# Altium schematic sheet Connectors.SchDoc
size A4; SheetNumber: 4; SheetTotal: 4
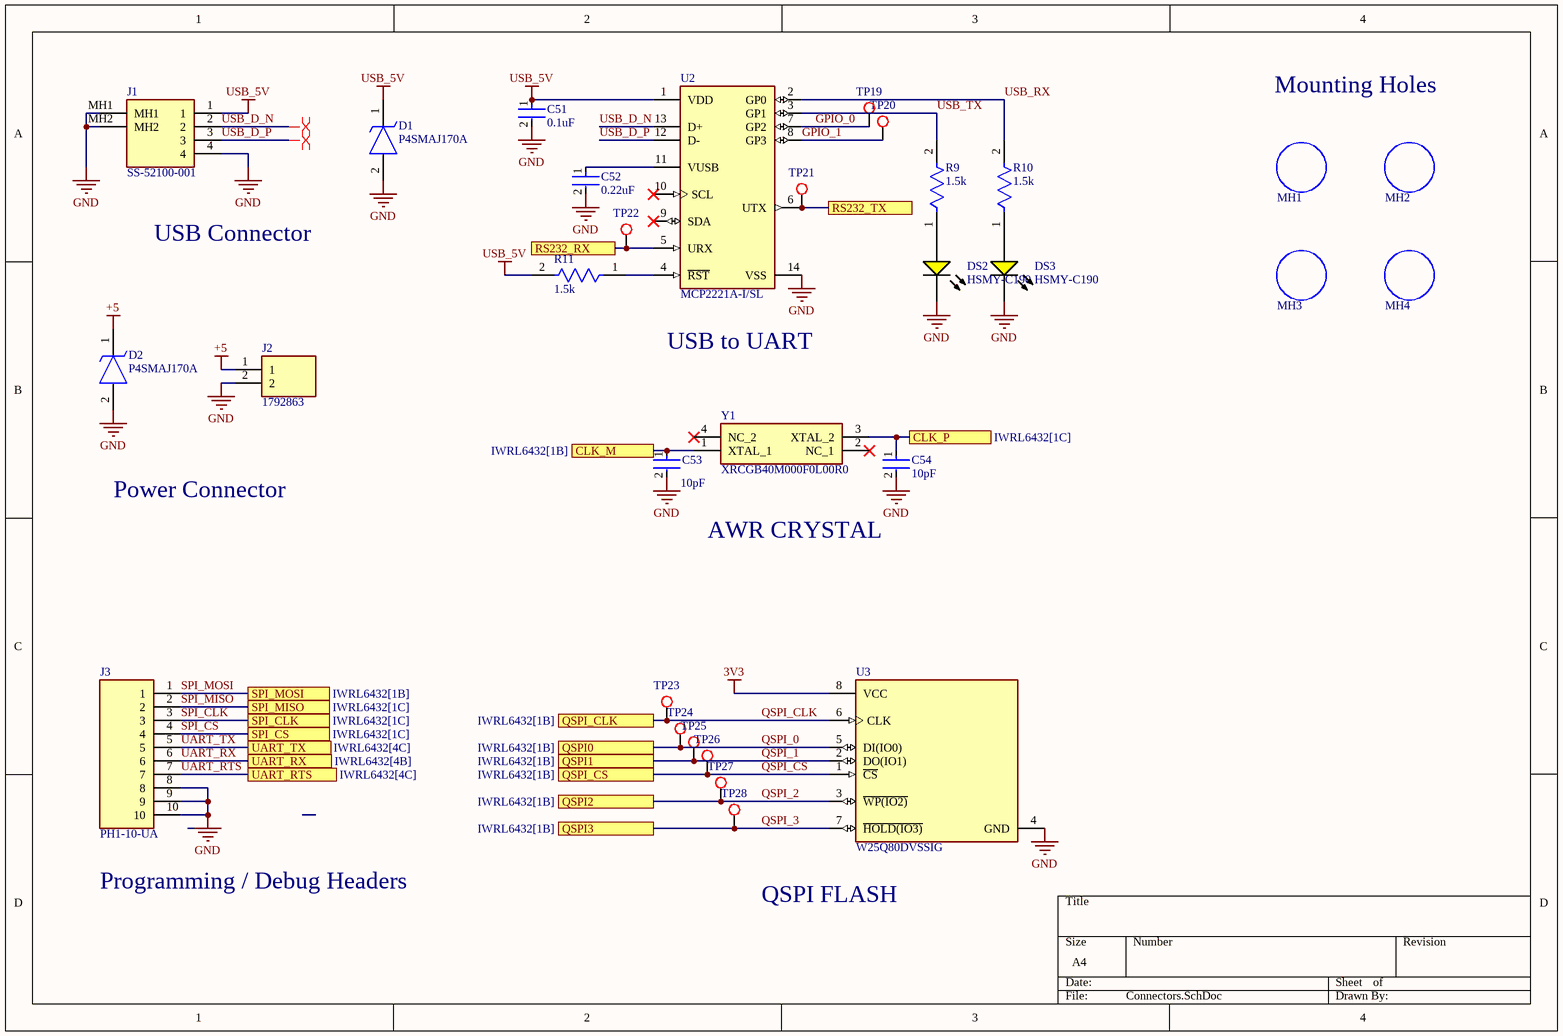
[diagram p0: Connectors.SchDoc]

## Parts
C51  0.1uF  [FP-CC0603-DA-MFG]
C52  0.22uF  [FP-C0603C-CF-MFG]
C53  10pF  [FP-CL10-IPC_B]
C54  10pF  [FP-CL10-IPC_B]
D1  P4SMAJ170A  [DIOM5027X240N]
D2  P4SMAJ170A  [DIOM5027X240N]
DS2  HSMY-C190  [AVAG-HSMX-C190_V]
DS3  HSMY-C190  [AVAG-HSMX-C190_V]
J1  SS-52100-001  [SS52100001]
J2  1792863  [1792863]
J3  PH1-10-UA  [HDRV10W64P0X254_1X10_2540X249X886P]
MH1  MH?  [Mounting Hole]  (value not drawn)
MH2  MH?  [Mounting Hole]  (value not drawn)
MH3  MH?  [Mounting Hole]  (value not drawn)
MH4  MH?  [Mounting Hole]  (value not drawn)
R9  1.5k  [FP-RC1608-IPC_B]
R10  1.5k  [FP-RC1608-IPC_B]
R11  1.5k  [FP-RC1608-IPC_B]
TP19  TP_1  [Testpoint]  (value not drawn)
TP20  TP_1  [Testpoint]  (value not drawn)
TP21  TP_1  [Testpoint]  (value not drawn)
TP22  TP_1  [Testpoint]  (value not drawn)
TP23  TP_1  [Testpoint]  (value not drawn)
TP24  TP_1  [Testpoint]  (value not drawn)
TP25  TP_1  [Testpoint]  (value not drawn)
TP26  TP_1  [Testpoint]  (value not drawn)
TP27  TP_1  [Testpoint]  (value not drawn)
TP28  TP_1  [Testpoint]  (value not drawn)
U2  MCP2221A-I/SL  [FP-C04-065-SL-MFG]
U3  W25Q80DVSSIG  [FP-SS-MFG]
Y1  XRCGB40M000F0L00R0  [XRCGB]

## Ports
CLK_M (see IWRL6432[1B]), CLK_P (see IWRL6432[1C]), QSPI0 (see IWRL6432[1B]), QSPI1 (see IWRL6432[1B]), QSPI2 (see IWRL6432[1B]), QSPI3 (see IWRL6432[1B]), QSPI_CLK (see IWRL6432[1B]), QSPI_CS (see IWRL6432[1B]), RS232_RX (see IWRL6432[4A]), RS232_TX (see IWRL6432[1C]), SPI_CLK (see IWRL6432[1C]), SPI_CS (see IWRL6432[1C]), SPI_MISO (see IWRL6432[1C]), SPI_MOSI (see IWRL6432[1B]), UART_RTS (see IWRL6432[4C]), UART_RX (see IWRL6432[4B]), UART_TX (see IWRL6432[4C])

## Nets
3V3: U3.8(VCC)
+5: D2.1(K) J2.1
GND: C51.2 C52.2 C53.2 C54.2 D1.2(A) D2.2(A) DS2.2(K) DS3.2(K) J1.4 J1.MH1 J1.MH2 J2.2 J3.8 J3.9 J3.10 U2.14(VSS) U3.4(GND)
USB_5V: C51.1 D1.1(K) J1.1 R11.2 U2.1(VDD)
CLK_M: C53.1 Y1.1(XTAL_1) ; port CLK_M
CLK_P: C54.1 Y1.3(XTAL_2) ; port CLK_P
GPIO_0: TP19.0 U2.7(GP2)
GPIO_1: TP20.0 U2.8(GP3)
QSPI_0: TP24.0 U3.5(DI(IO0)) ; port QSPI0
QSPI_1: TP25.0 U3.2(DO(IO1)) ; port QSPI1
QSPI_2: TP27.0 U3.3(~{WP(IO2)}) ; port QSPI2
QSPI_3: TP28.0 U3.7(~{HOLD(IO3)}) ; port QSPI3
QSPI_CLK: TP23.0 U3.6(CLK) ; port QSPI_CLK
QSPI_CS: TP26.0 U3.1(~{CS}) ; port QSPI_CS
RS232_RX: TP22.0 U2.5(URX) ; port RS232_RX
RS232_TX: TP21.0 U2.6(UTX) ; port RS232_TX
SPI_CLK: J3.3 ; port SPI_CLK
SPI_CS: J3.4 ; port SPI_CS
SPI_MISO: J3.2 ; port SPI_MISO
SPI_MOSI: J3.1 ; port SPI_MOSI
UART_RTS: J3.7 ; port UART_RTS
UART_RX: J3.6 ; port UART_RX
UART_TX: J3.5 ; port UART_TX
USB_D_N: J1.2 U2.13(D+)
USB_D_P: J1.3 U2.12(D-)
USB_RX: R10.2 U2.2(GP0)
USB_TX: R9.2 U2.3(GP1)
NetC52_1: C52.1 U2.11(VUSB)
NetDS2_1: DS2.1(A) R9.1
NetDS3_1: DS3.1(A) R10.1
NetR11_1: R11.1 U2.4(~{RST})

Not connected (* = marked no-connect by the designer): U2 9(SDA)* 10(SCL)*; Y1 2(NC_1)* 4(NC_2)*

## Layout directives
differential pair: USB_D_N, USB_D_P

## Notes on the sheet
- Mounting Holes
- USB Connector
- USB to UART
- Power Connector
- AWR CRYSTAL
- Programming / Debug Headers
- QSPI FLASH

## Library data of the parts
C51 = CMP-03422-001228-1: CAP CER 0.1UF 10V X7R 0603; Manufacturer Part Number: CC0603KRX7R6BB104; Manufacturer: YAGEO; Material: Ceramic; Tolerance: 0.1; Capacitance: 100 nF; Temperature Coefficient: 15%; Value: 100 nF; Height: 0.9mm; RoHS: TRUE; Footprint Url: http://www.yageo.com/exep/pages/download/literatures/UPY-C_GEN_24.pdf; Octopart: https://octopart.com/cc0603krx7r6bb104-yageo-9291607; Device Class L1: Passive Components; Mouser Description: 0603 0.1 uF 10 V ±10 % Tolerance X7R SMT Multilayer Ceramic Capacitor; ComponentLink2URL: http://www.yageo.com/documents/recent/UPY-GPHC_X7R_6.3V-to-50V_18.pdf; Automotive: No; Voltage: 10 V; Device Class L3: Ceramic Capacitors; Category: Cap; Temperature: -55°C to +125°C; ComponentLink2Description: Datasheet; Voltage Rating: 10 V; Device Class L2: Capacitors; Lead Free: Yes; Temperature Range High: +125°C; Temperature Range Low: -55°C; Digikey Description: CAP CER 0.1UF 10V X7R 0603; Package: CC0603-DA; Temperature Characteristic: X7R
C52 = CMP-03020-026996-1: C0603 0.22 μF X7R 30ppm/°C 10.00% 10 V; Manufacturer Part Number: C0603C224K8RAC; Manufacturer: KEMET; Capacitance: 0.22 μF; Automotive Grade: Grade 1; Material: Ceramic; Value: 0.22 μF; Voltage Rating: 10 V; Tolerance: 0.1; Device Class L2: Capacitors; Temperature Range High: +125°C; RoHS: TRUE; Device Class L1: Passive Components; Temperature: -55°C to +125°C; Temperature Coefficient: 30ppm/°C; ComponentLink2Description: Datasheet; Device Class L3: Ceramic Capacitors; ComponentLink2URL: https://api.kemet.com/component-edge/download/datasheet/C0603C100J5GACAUTO.pdf; Category: Cap; Lead Free: Yes; Automotive: Yes; Height: 0.87mm; Temperature Characteristic: X7R; Mouser Description: Multilayer Ceramic Capacitors MLCC - SMD/SMT 50volts 0.22 uF C0G X7R; Octopart: https://octopart.com/c0603c224k8rac-kemet-7455784; Package: C0603C-CF; Temperature Range Low: -55°C
C53 C54 = CMP-13271-001771-1: Cap Ceramic 10pF 50V C0G ±0.25pF Pad SMD 0603 +125°C T/R; Temperature Coefficient: 300ppm/°C; Height: 0.8mm; Package Quantity: 1; Radiation Hardening: No; Voltage: 50V; Case/Package: 0603; Max Operating Temperature: 125°C; Material: Ceramic; Case Code (Metric): 1608; Depth: 0.8mm; Length: 1.6mm; Thickness: 0.035inch; Width: 0.031inch; Lead Free: Lead Free; Packaging: Tape and Reel; Mount: Surface Mount; Voltage Rating: 50V; Min Operating Temperature: -55°C; Dielectric: C0G; Capacitance: 10pF; Case Code (Imperial): 0603; Voltage Rating (DC): 50V
D1 D2 = P4SMAJ170A: TVS Diode (Uni-directional); Manufacturer_Name: Diotec; Datasheet Link: https://diotec.com/request/datasheet/p4smaj65.pdf; Height: 2.4mm; Manufacturer_Part_Number: P4SMAJ170A
DS2 DS3 = CMP-1744-00003-1: LED Uni-Color Yellow, 65 mW, 20 mA, -40 to 85 degC, 2-Pin SMD, RoHS, Tape and Reel; Tolerance: 1%; Voltage Rating: 50 V; Power Rating: 100 mW; Case\Package: 0603; Resistance: 390 Ohm; Min Operating Temperature: -55 degC; Length: 1.6 mm; ComponentLink3Description: Package Specification; Mount: Surface Mount; PackageReference: HSMX-C190; ComponentLink2Description: Datasheet; DatasheetVersion: Mar-12; Case Code (Metric): 1608; Pins: 2; Package Quantity: 5000; ComponentLink2URL: http://docs.avagotech.com/docs/AV02-0551EN; ComponentLink1Description: Manufacturer URL; RoHSCompliant: true; Packaging: Tape and Reel; PackageDescription: 2-Pin Surface Mount Device, Body 1.6 x 0.8 mm, Height 0.9 mm; REACH SVHC: No SVHC; ComponentLink3URL: http://www.fairchildsemi.com/dwg/MA/MA03D.pdf; Voltage Rating (DC): 50 V; Width: 0.8 mm; ComponentLink1URL: http://www.avagotech.com/; Max Operating Temperature: 155 degC; Case Code (Imperial): 0603; Height: 0.45 mm
J1 = SS-52100-001: Connector; Manufacturer_Name: BelFuse; Datasheet Link: https://componentsearchengine.com/Datasheets/1/SS-52100-001.pdf; Height: 6.9mm; Manufacturer_Part_Number: SS-52100-001; Mouser Part Number: 530-SS-52100-001; Mouser Price/Stock: https://www.mouser.co.uk/ProductDetail/Stewart-Connector-Bel/SS-52100-001?qs=0lQeLiL1qyZpDP8aQUpKcQ%3D%3D; Arrow Part Number: SS-52100-001; Arrow Price/Stock: https://www.arrow.com/en/products/ss-52100-001/stewart-connector-systems?region=nac
J2 = 1792863: Connector; Manufacturer_Name: Phoenix Contact; Datasheet Link: https://www.phoenixcontact.com/online/portal/pi/pxc/product_detail_page/!ut/p/z1/5VddT_IwFP4rvBfcWdp9j0ucREDRGUDZbpa260h1X24V1F9vCzNEo_PCePFmy0nWduec9nl6DuGBIVzDMMdbvsGCFzlO5TwI7cjVL7zJuanNkTlx0c2Vfzm6ufENfaTDWxjCsGYpo4LFHhZsU1QvMBhdXqoPAhMY6GpUUvoAAx9oGk; Height: 10.65mm; Manufacturer_Part_Number: 1792863; Mouser Part Number: 651-1792863; Mouser Price/Stock: https://www.mouser.co.uk/ProductDetail/Phoenix-Contact/1792863?qs=YjJcVSlHJPU69DDcZ8WVCg%3D%3D; Arrow Part Number: 1792863; Arrow Price/Stock: https://www.arrow.com/en/products/1792863/phoenix-contact?region=nac
J3 = PH1-10-UA: Connector; Manufacturer_Name: Adam Tech; Datasheet Link: https://app.adam-tech.com/products/download/data_sheet/201605/ph1-xx-ua-data-sheet.pdf; Height: 8.865mm; Manufacturer_Part_Number: PH1-10-UA; Mouser Part Number: 737-PH1-10-UA; Mouser Price/Stock: https://www.mouser.co.uk/ProductDetail/Adam-Tech/PH1-10-UA?qs=ogqIPVdloe%252Bff9mnAAAy9w%3D%3D; Arrow Part Number: PH1-10-UA; Arrow Price/Stock: null?utm_currency=USD&region=nac
MH1-MH4 = Mounting Hole
R9-R11 = CMP-13261-004935-1: Res Thick Film 0603 1.5kΩ 1% 0.1W ±100ppm/°C Molded SMD T/R; Resistance: 1.5kR; Voltage Rating (DC): 50V; Power Rating: 100mW; Contact Plating: Tin; Depth: 0.8mm; Width: 800um; Tolerance: 1%; Lead Free: Lead Free; Composition: Thick Film; Military Standard: Not; Temperature Coefficient: 100ppm/°C; Radiation Hardening: No; Length: 1.6mm; Case/Package: 0603; Max Operating Temperature: 155°C; Packaging: Tape and Reel; Min Operating Temperature: -55°C
TP19-TP28 = Testpoint
U2 = CMP-06284-000011-1: IC USB TO I2C/UART 14SOIC; Manufacturer: Microchip; Min Supply Voltage: 3V; Usb Standard: USB 2.0; Max Supply Voltage: 5.5V; Nominal Supply Current: 10-13mA; Automotive Grade: Grade 3; Interface: I2C,UART,USB; Standoff Height: 0.1mm; Max Junction Temp: +150°C; Data Rate: 12Mbits/s; Lead Free: Yes; Height: 1.75mm; Octopart: https://octopart.com/mcp2221a-i%2Fsl-microchip-71704986; Package: C04-065-SL; Digikey Description: IC USB TO I2C/UART 14SOIC; Temperature Range Low: -40°C; Temperature: -40°C to +85°C; Category: IC; Temperature Range High: +85°C; Ambient Temperature Range Low: -40°C; Device Class L1: Integrated Circuits (ICs); Footprint Url: http://ww1.microchip.com/downloads/en/DeviceDoc/14L%20SOIC%203_90%20mm%20%28SL%29%20C04-00065d.pdf; Automotive: Yes; ComponentLink2URL: http://ww1.microchip.com/downloads/en/DeviceDoc/20005565B.pdf; Ambient Temperature Range High: +85°C; RoHS: TRUE; Device Class L3: USB Interface ICs; ComponentLink2Description: Datasheet; Device Class L2: Interface ICs; Manufacturer Part Number: MCP2221A-I/SL; Ipc Land Pattern Name: SOIC127P600X175-14
U3 = CMP-2000-07408-2: IC FLASH 8MBIT SPI 104MHZ 8SOIC; Memory Type: Non-Volatile; Memory Size: 8Mb; Frequency: 104MHz; Min Operating Temperature: -40°C; Mount: Surface Mount; RoHS Compliant: Yes; Packaging: Rail/Tube; Case/Package: SOIC; Max Operating Temperature: 85°C; Series: SpiFlash®; Interface: SPI
Y1 = XRCGB40M000F0L00R0: Crystal or Oscillator; Manufacturer_Name: Murata Electronics; Datasheet Link: https://www.murata.com/products/productdata/8801066844190/SPEC-XRCGB40M000F0L00R0.pdf; Height: 0.7mm; Manufacturer_Part_Number: XRCGB40M000F0L00R0; Mouser Part Number: 81-XRCGB40M000F0L0R0; Mouser Price/Stock: https://www.mouser.co.uk/ProductDetail/Murata-Electronics/XRCGB40M000F0L00R0?qs=e%252BE4OD6MgMeIG7IAXBIJgA%3D%3D